# EasyEDA schematic ShiftRegV1_3.json

## Sheets
1 Sheet_2: TITLE: Sheet_1; REV: 1.0; Date: 2022-09-06; Sheet: 1/1; Company: FABAMAQ
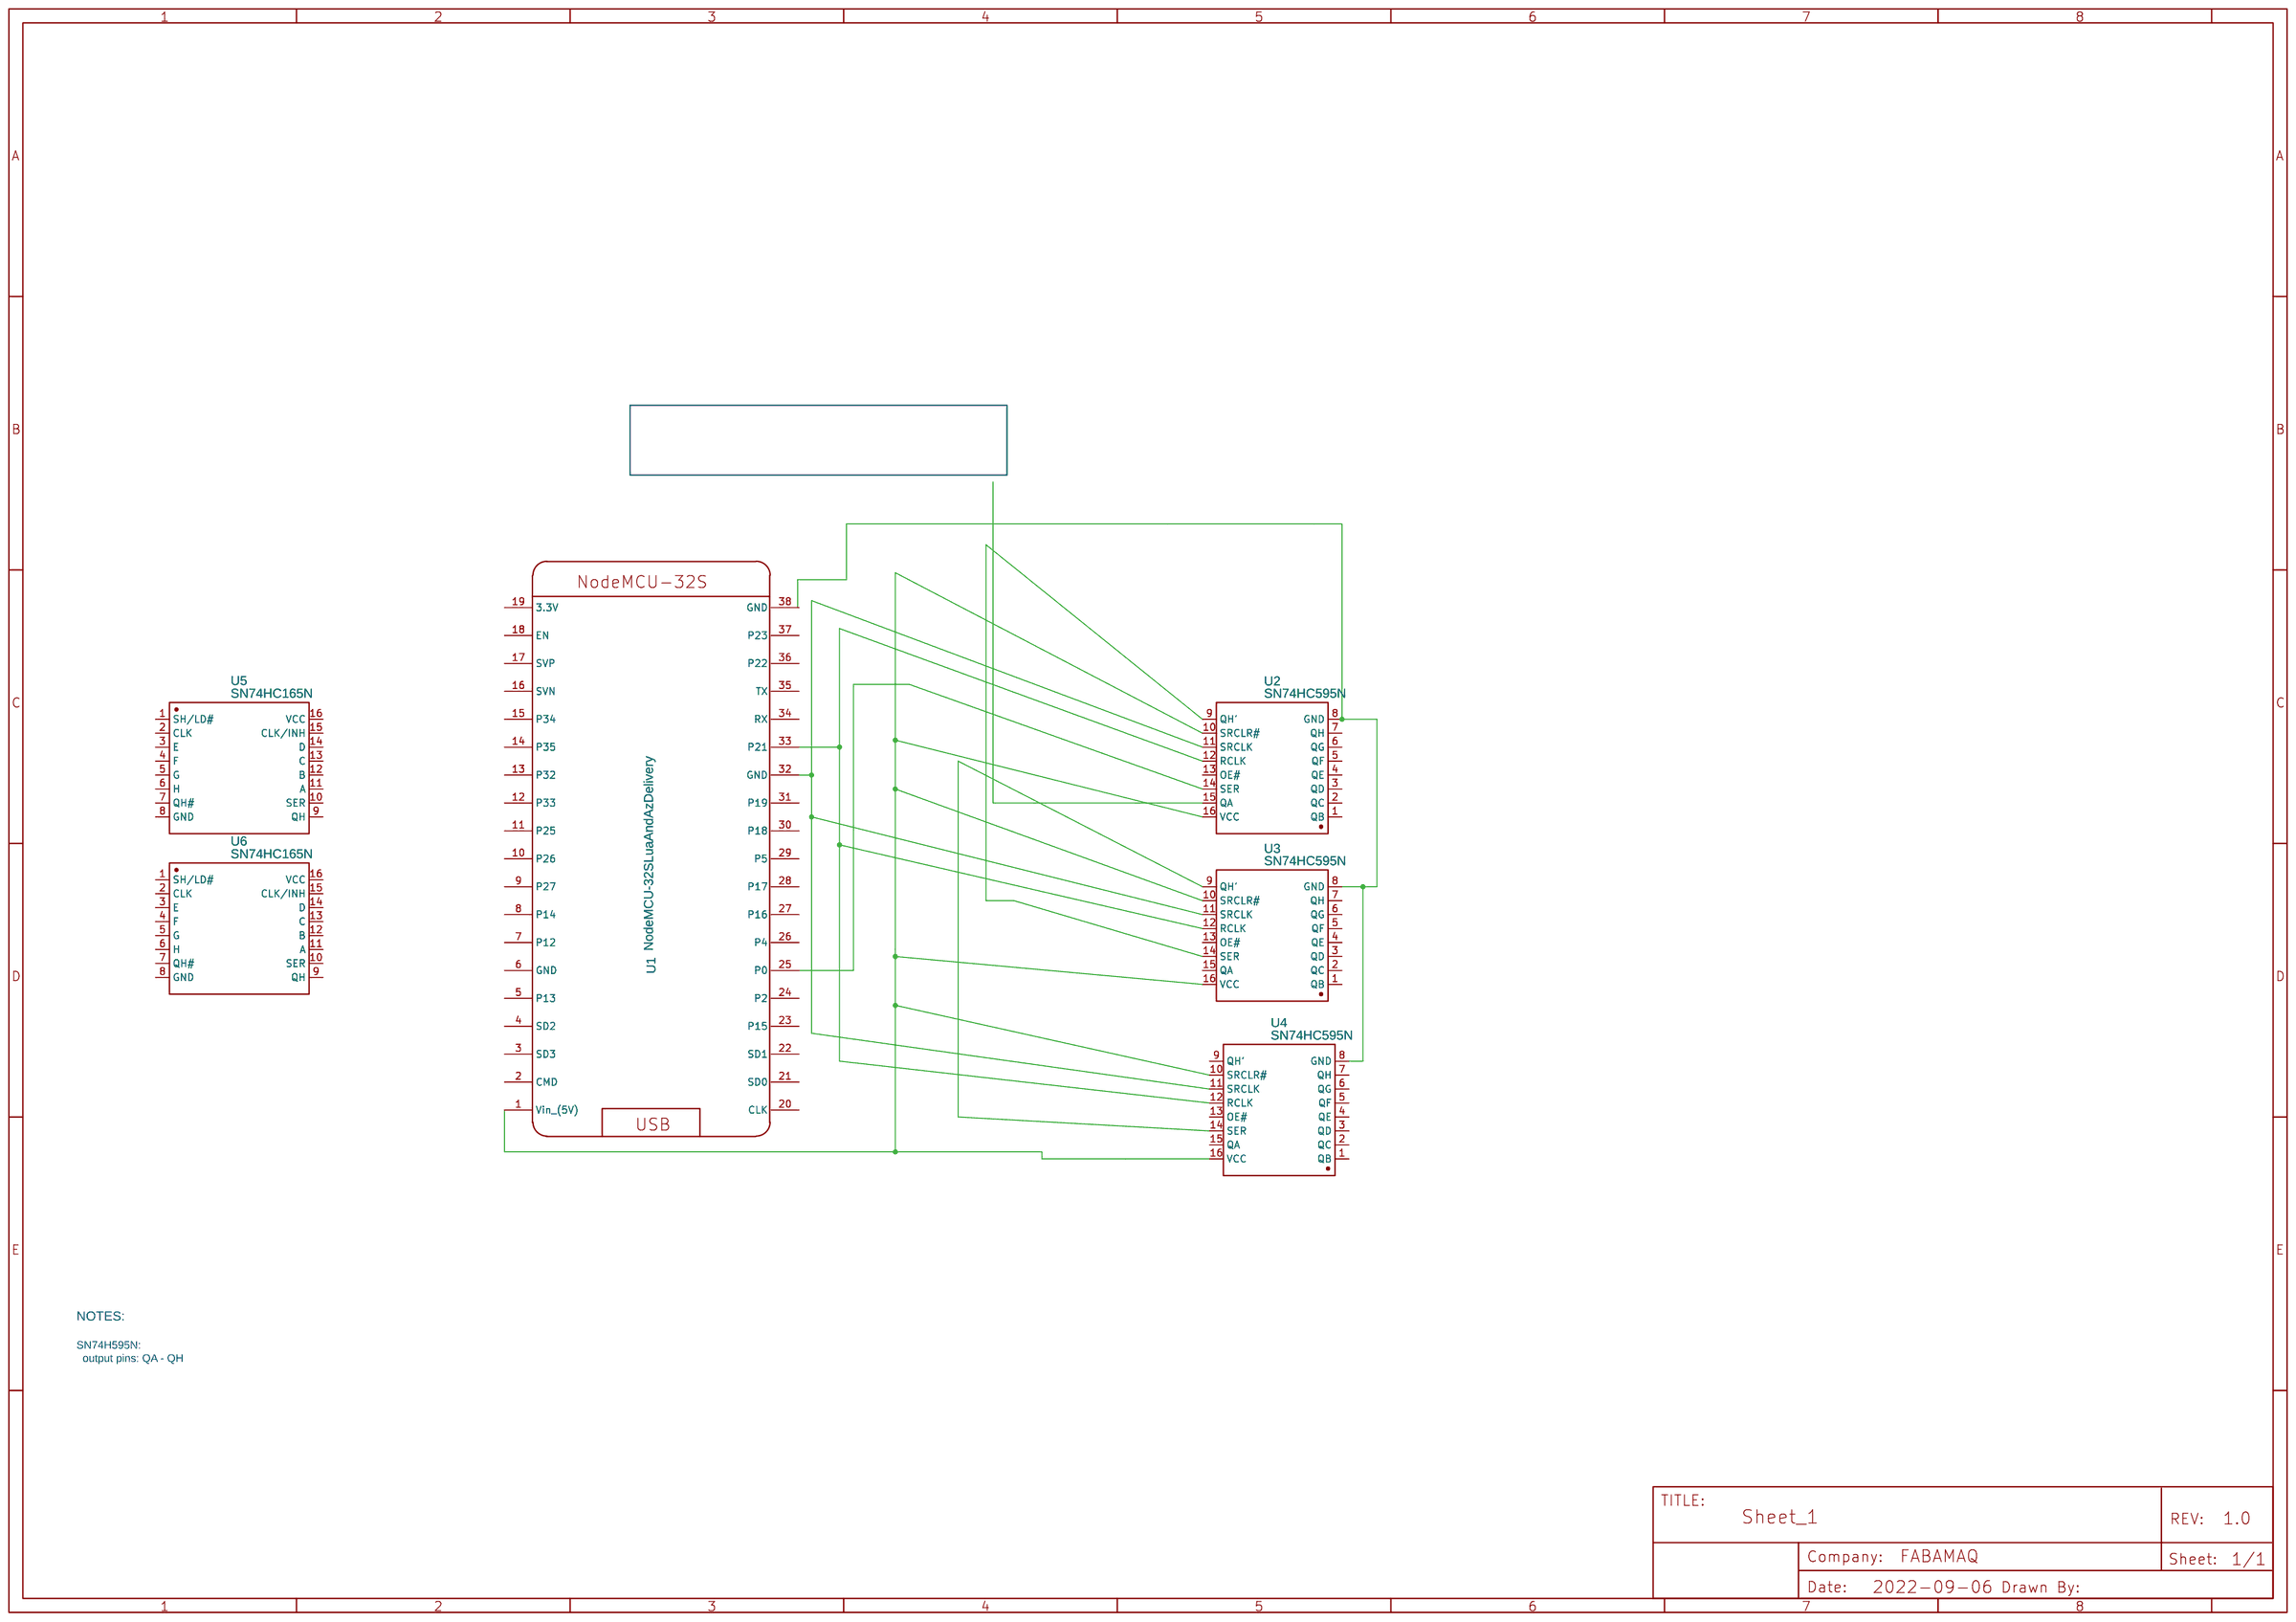
[diagram p0: Sheet_2]
2 Sheet_1: Company: Your Company
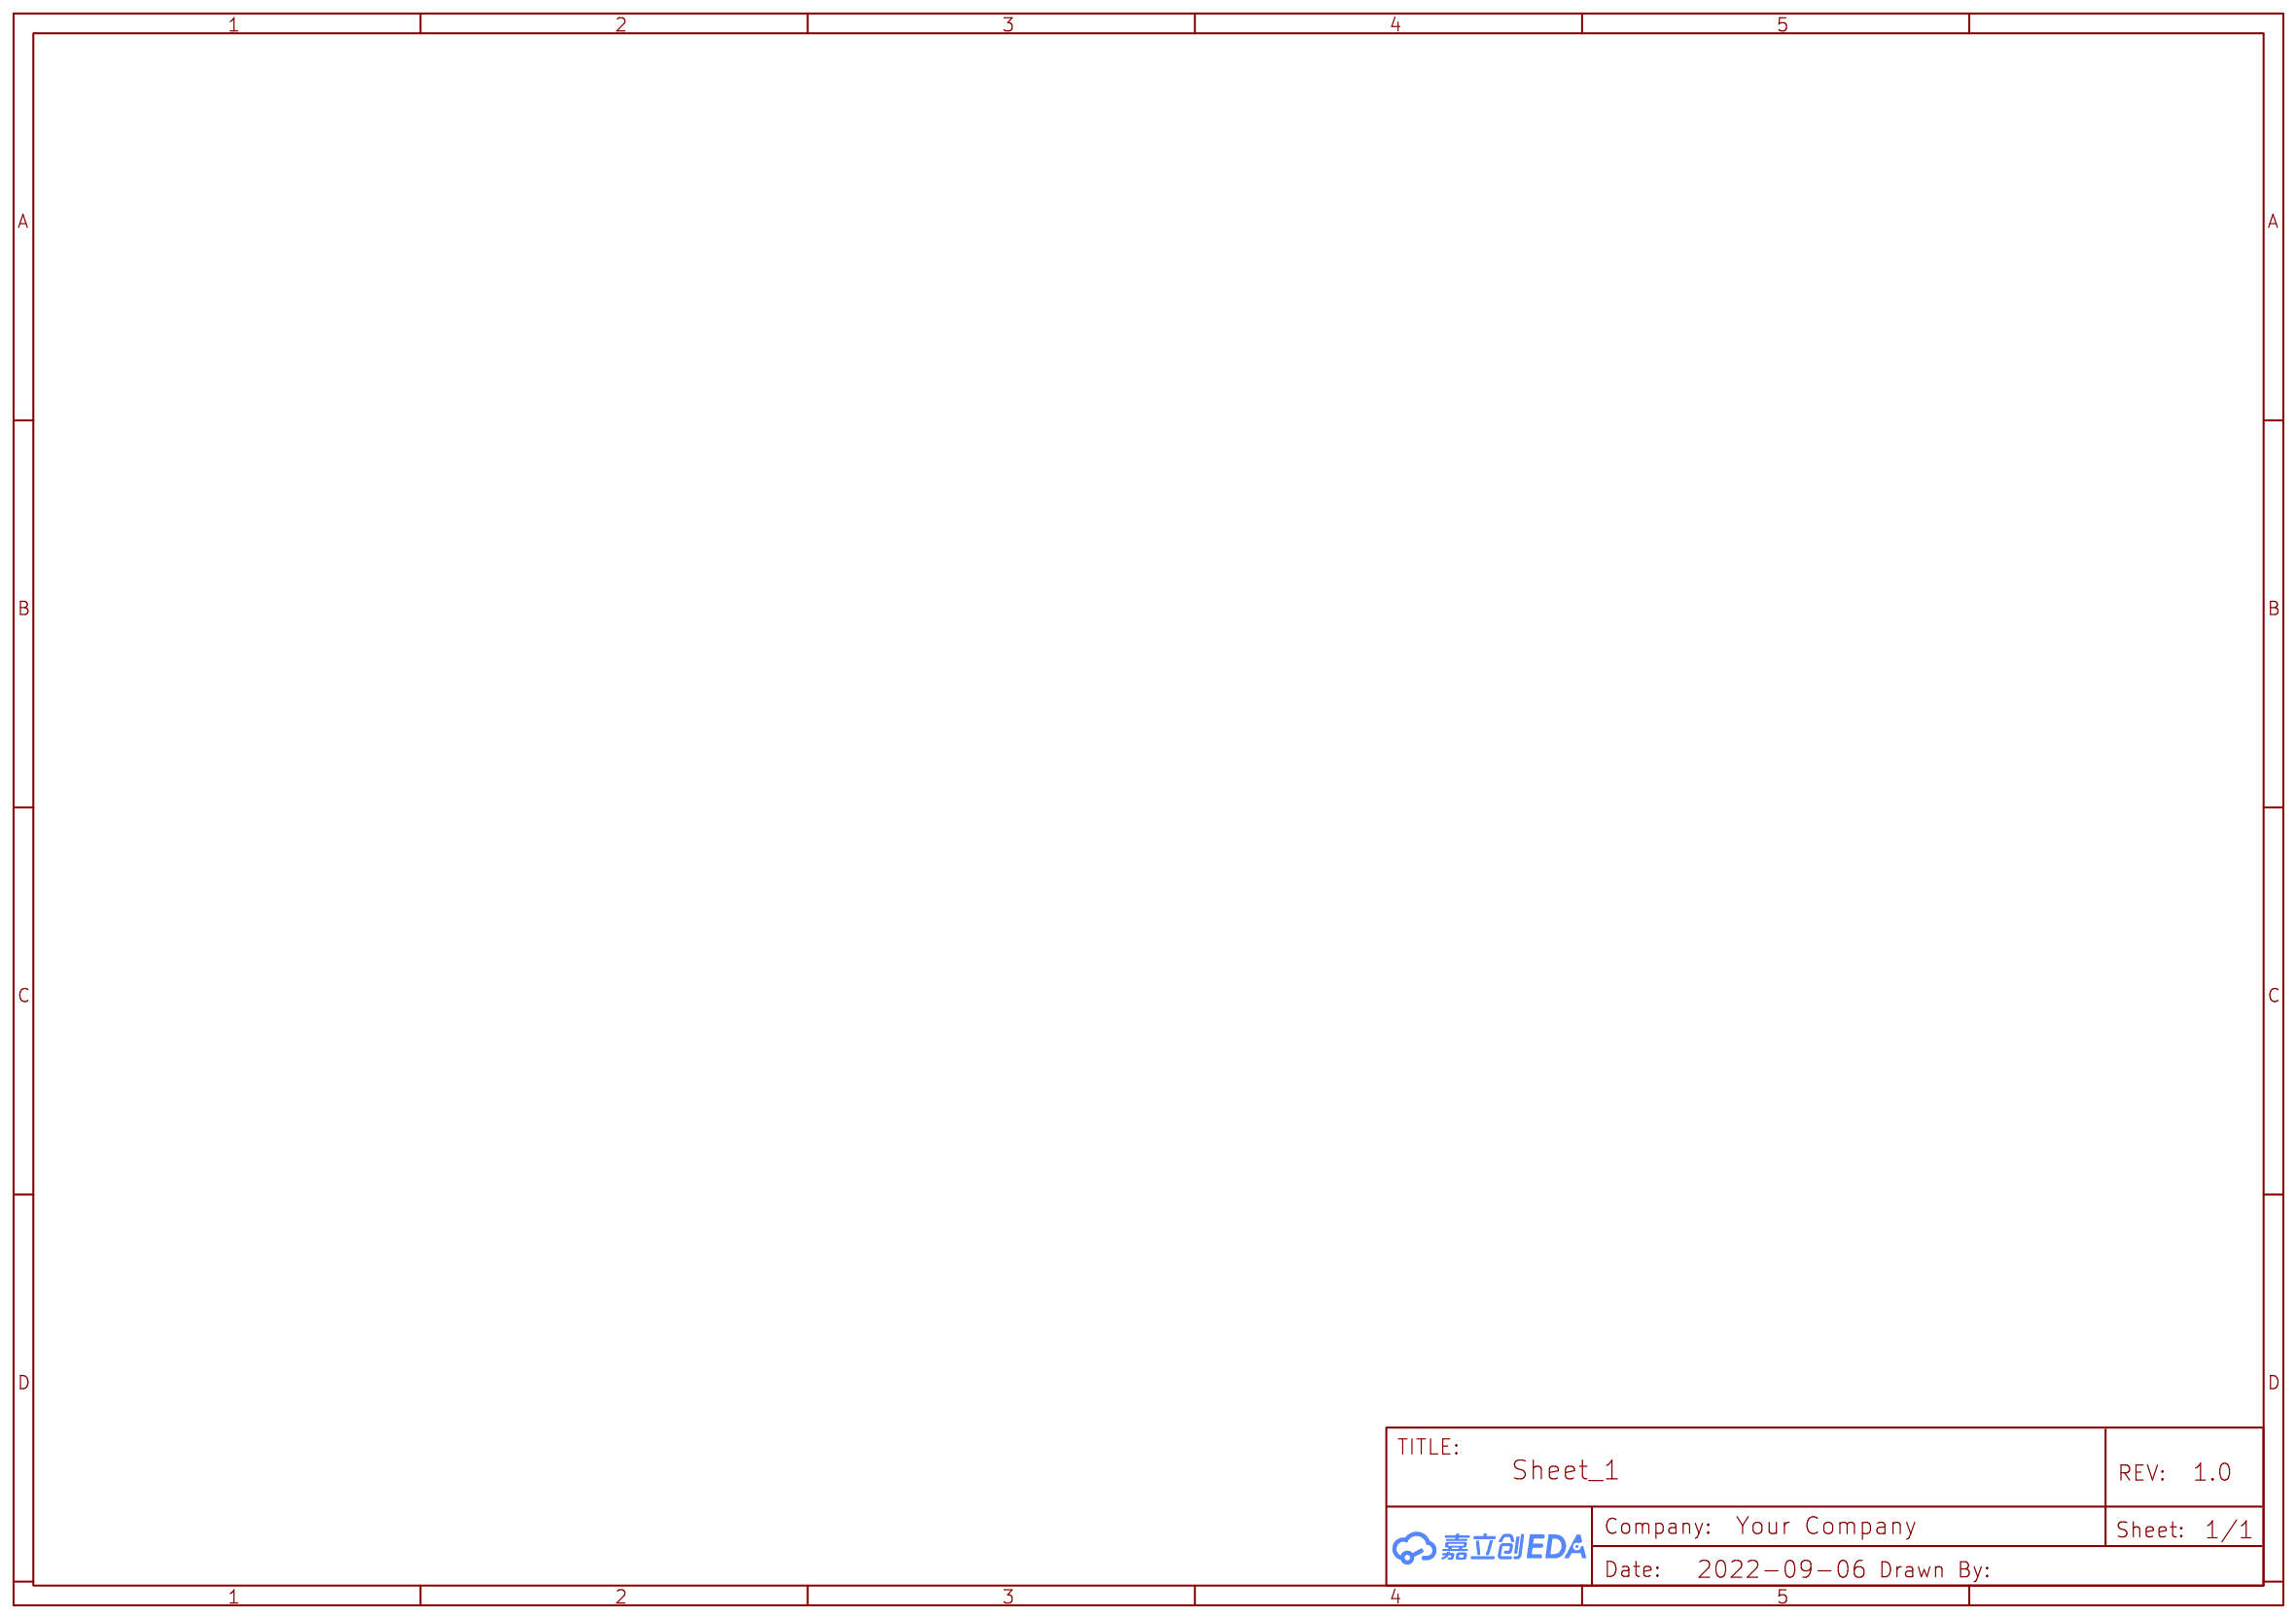
[diagram p1: Sheet_1]

## Parts
U1  NodeMCU-32SLuaAndAzDelivery  [NODEMCU-32SLUA]
U2  SN74HC595N  [DIP-16_L19.8-W6.5-P2.54-LS7.6-BL]
U3  SN74HC595N  [DIP-16_L19.8-W6.5-P2.54-LS7.6-BL]
U4  SN74HC595N  [DIP-16_L19.8-W6.5-P2.54-LS7.6-BL]
U5  SN74HC165N  [DIP-16_L19.8-W6.5-P2.54-LS7.6-BL]
U6  SN74HC165N  [DIP-16_L19.8-W6.5-P2.54-LS7.6-BL]

## Library data of the parts
U1 = NodeMCU-32SLuaAndAzDelivery: Supplier: LCSC; Supplier Part: C111436; Manufacturer: Ai-Thinker; Manufacturer Part: NodeMCU-32SLua; Contributor: biohofbolten; link: https://lcsc.com/product-detail/Modules_NodeMCU-32S-Lua_C111436.html
U2-U4 = SN74HC595N: Supplier: LCSC; Manufacturer: TI; Supplier Part: C78711; JLCPCB Part Class: Extended Part
U5 U6 = SN74HC165N: Supplier: LCSC; Manufacturer: TI; Supplier Part: C2909; JLCPCB Part Class: Extended Part

## Nets
Net-(U1-1): U1.1(Vin (5V)) U2.10(SRCLR#) U2.16(VCC) U3.10(SRCLR#) U3.16(VCC) U4.10(SRCLR#) U4.16(VCC)
Net-(U1-25): U1.25(P0) U2.14(SER)
Net-(U1-32): U1.32(GND) U2.11(SRCLK) U3.11(SRCLK) U4.11(SRCLK)
Net-(U1-33): U1.33(P21) U2.12(RCLK) U3.12(RCLK) U4.12(RCLK)
Net-(U1-38): U1.38(GND) U2.8(GND) U3.8(GND) U4.8(GND)
Net-(U2-9): U2.9(QH') U3.14(SER)
Net-(U3-9): U3.9(QH') U4.14(SER)

Not connected (* = marked no-connect by the designer): U1 2(CMD) 3(SD3) 4(SD2) 5(P13) 6(GND) 7(P12) 8(P14) 9(P27) 10(P26) 11(P25) 12(P33) 13(P32) 14(P35) 15(P34) 16(SVN) 17(SVP) 18(EN) 19(3.3V) 20(CLK) 21(SD0) 22(SD1) 23(P15) 24(P2) 26(P4) 27(P16) 28(P17) 29(P5) 30(P18) 31(P19) 34(RX) 35(TX) 36(P22) 37(P23); U2 1(QB) 2(QC) 3(QD) 4(QE) 5(QF) 6(QG) 7(QH) 13(OE#) 15(QA); U3 1(QB) 2(QC) 3(QD) 4(QE) 5(QF) 6(QG) 7(QH) 13(OE#) 15(QA); U4 1(QB) 2(QC) 3(QD) 4(QE) 5(QF) 6(QG) 7(QH) 9(QH') 13(OE#) 15(QA); U5 1(SH/LD#) 2(CLK) 3(E) 4(F) 5(G) 6(H) 7(QH#) 8(GND) 9(QH) 10(SER) 11(A) 12(B) 13(C) 14(D) 15(CLK/INH) 16(VCC); U6 1(SH/LD#) 2(CLK) 3(E) 4(F) 5(G) 6(H) 7(QH#) 8(GND) 9(QH) 10(SER) 11(A) 12(B) 13(C) 14(D) 15(CLK/INH) 16(VCC)

## Notes on the sheets
sheet 1
- NOTES:
- SN74H595N:
    output pins: QA - QH
